# EAGLE design 16bit_Wing_Template (EAGLE 5.11)
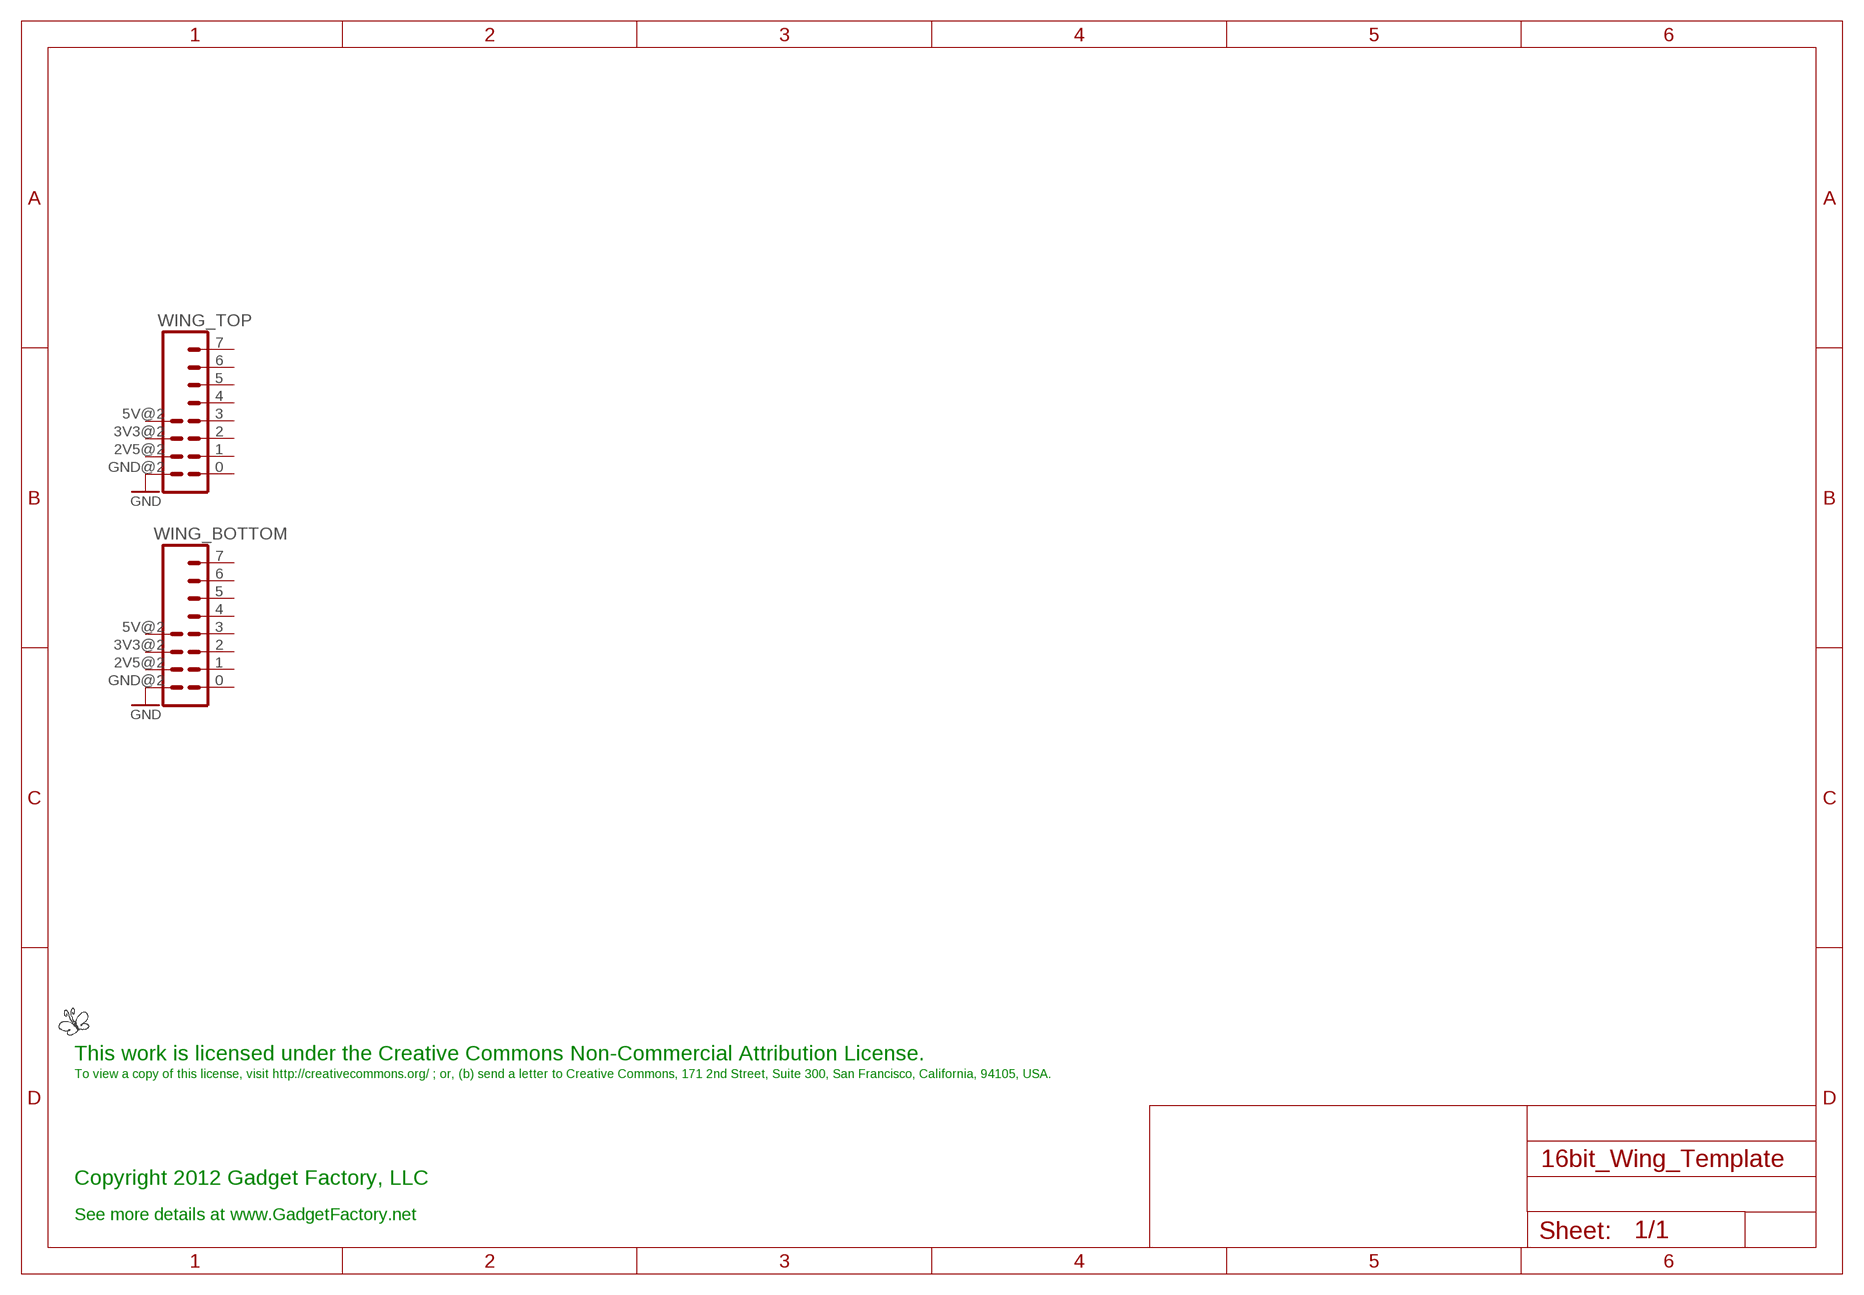
[diagram p0: schematic, sheet 1]

## Parts
LOGO1  BUTTERFLY_LOGO  [BUTTERFLY_LOGO]
WING_BOTTOM  WING8  [WINGSIDE_8BIT]
WING_TOP  WING8  [WINGSIDE_8BIT]

## Nets
GND: WING_BOTTOM.GND@2(GND) WING_TOP.GND@2(GND)
Unconnected: WING_BOTTOM.0 WING_BOTTOM.1 WING_BOTTOM.2 WING_BOTTOM.2V5@2(2V5) WING_BOTTOM.3 WING_BOTTOM.3V3@2(3V3) WING_BOTTOM.4 WING_BOTTOM.5 WING_BOTTOM.5V@2(5V) WING_BOTTOM.6 WING_BOTTOM.7 WING_TOP.0 WING_TOP.1 WING_TOP.2 WING_TOP.2V5@2(2V5) WING_TOP.3 WING_TOP.3V3@2(3V3) WING_TOP.4 WING_TOP.5 WING_TOP.5V@2(5V) WING_TOP.6 WING_TOP.7

## Notes on the sheet
- This work is licensed under the Creative Commons Non-Commercial Attribution License.
- To view a copy of this license, visit http://creativecommons.org/ ; or, (b) send a letter to Creative Commons, 171 2nd Street, Suite 300, San Francisco, California, 94105, USA.
- Copyright 2012 Gadget Factory, LLC
- See more details at www.GadgetFactory.net

## Library data of the parts
LOGO1 = GadgetFactory_Pub:BUTTERFLY_LOGO
WING_BOTTOM WING_TOP = Papilio:WING8

## Board
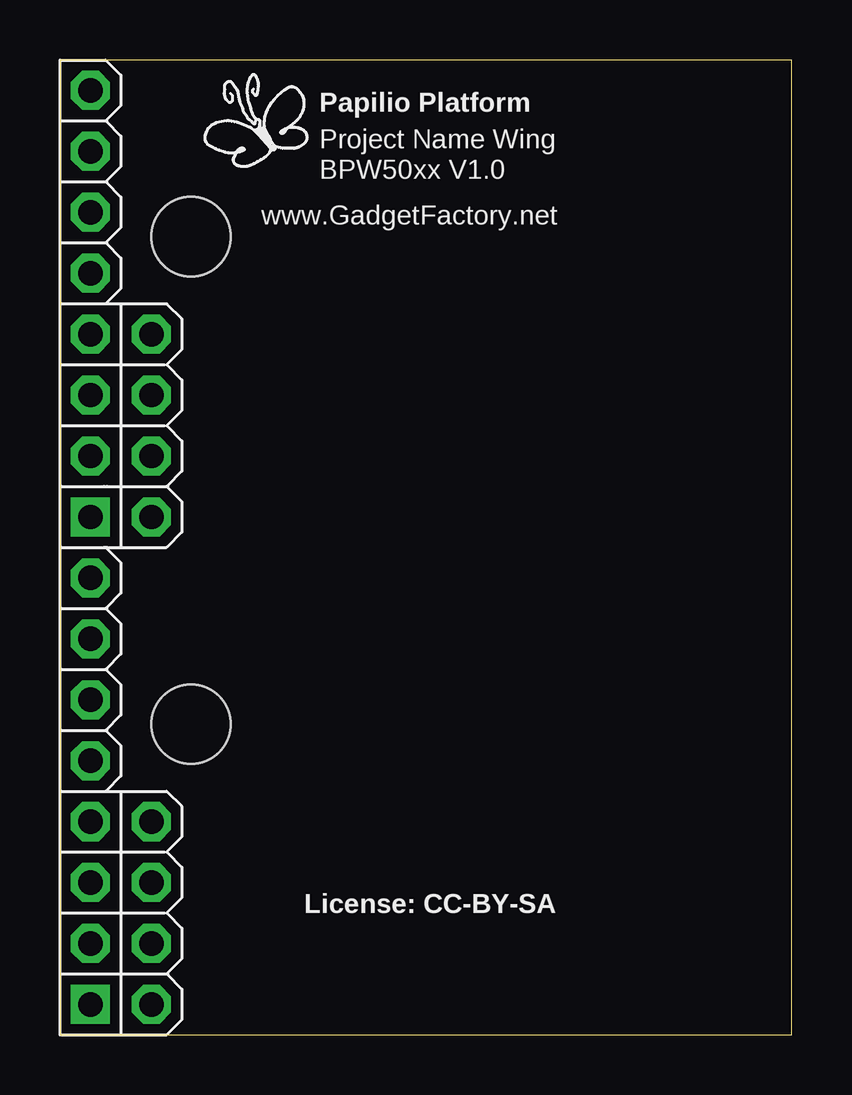
[diagram p1: board, top side]
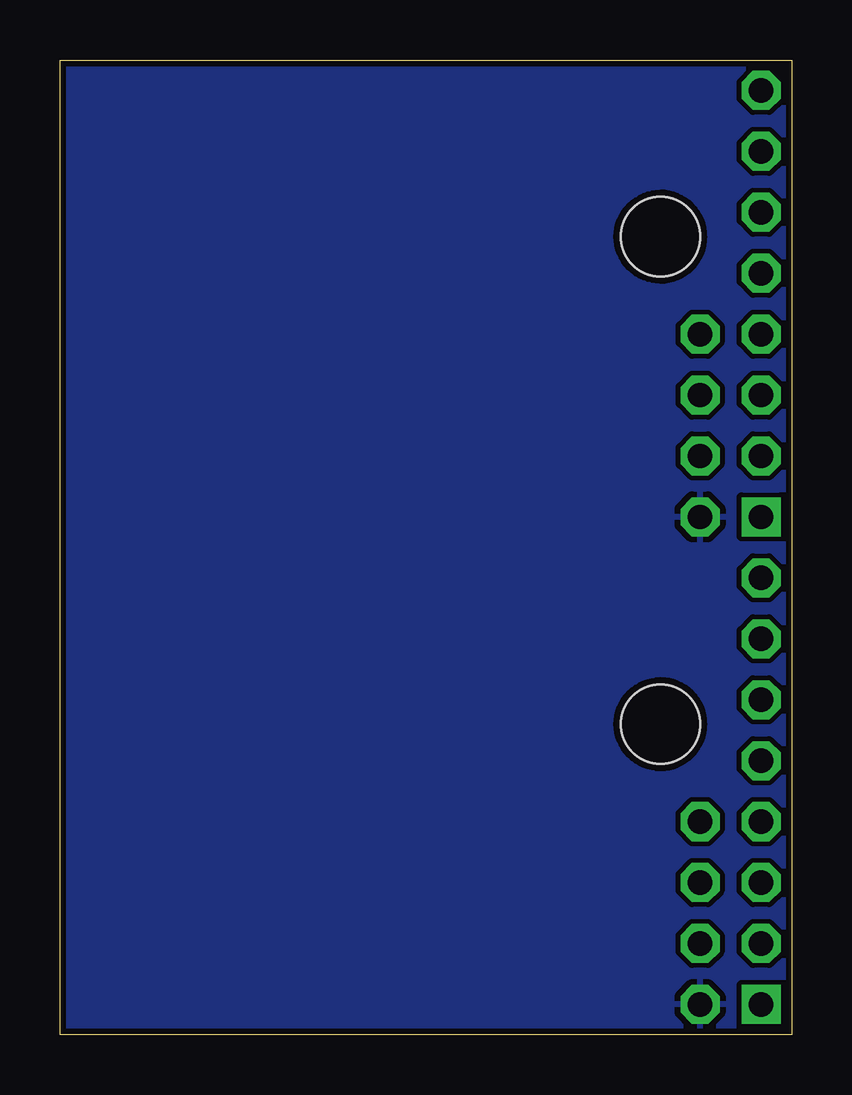
[diagram p2: board, bottom side, seen from below]

Size 30.48 x 40.64 mm. Coordinates in mm from the lower left corner, seen from the top.
Outline: 0,0 30.48,0 30.48,40.64 0,40.64 0,0
Copper layers (1*16): Top 0.035mm / dielectric 1.5mm / Bottom 0.035mm
Design rules "SparkFun_Derived_GoldePheonix_7mil": minimum track width 7mil, minimum drill 15mil, track to track 8mil, track to pad 8mil, pad to pad 8mil, via to via 8mil, smd to smd 8mil, copper to edge 10mil, drill to drill 8mil, minimum pad ring 12mil, minimum via ring 10mil, stop-mask expansion 4mil, vias tented up to drill 18mil, thermal gap 10mil

### Footprints (pad centres in the part's own frame; a part is rotated, then mirrored left to right if it is on the bottom)
WINGSIDE_8BIT = drill 1.016 square: 0 19.05,1.27 | drill 1.016 octagon: 1 16.51,1.27; 2 13.97,1.27; 2V5@2 16.51,3.81; 3 11.43,1.27; 3V3@2 13.97,3.81; 4 8.89,1.27; 5 6.35,1.27; 5V@2 11.43,3.81; 6 3.81,1.27; 7 1.27,1.27; GND@2 19.05,3.81 | hole 3.302: 7.366,5.461

### Placement (x,y rotation side)
LOGO1  8.26,37.59 0 top
WING_BOTTOM  0,20.32 270 top
WING_TOP  0,40.64 270 top

### Tracks (layer width: path | path; a pad name or v marks a point on that pad's centre or on a via)
GND
  pour Bottom: 0,40.64 30.48,40.64 30.48,0 0,0

### Text on the board
tPlace: Papilio Platform | Project Name Wing | BPW50xx V1.0 | www.GadgetFactory.net | License: CC-BY-SA